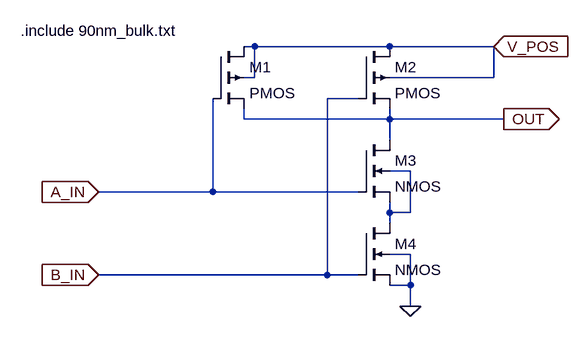
[diagram p0: schematic nand.asc]
nand.asc, the LTspice schematic file:
Version 4
SHEET 1 880 680
WIRE 96 48 80 48
WIRE 304 48 96 48
WIRE 464 48 304 48
WIRE 96 96 96 48
WIRE 96 96 80 96
WIRE 464 96 464 48
WIRE 464 96 304 96
WIRE 256 128 208 128
WIRE 80 160 80 144
WIRE 304 160 304 144
WIRE 304 160 80 160
WIRE 480 160 304 160
WIRE 304 192 304 160
WIRE 336 240 304 240
WIRE 32 272 32 128
WIRE 32 272 -144 272
WIRE 256 272 32 272
WIRE 304 304 304 288
WIRE 336 304 336 240
WIRE 336 304 304 304
WIRE 304 320 304 304
WIRE 336 368 304 368
WIRE 208 400 208 128
WIRE 208 400 -144 400
WIRE 256 400 208 400
WIRE 336 416 336 368
WIRE 336 416 304 416
WIRE 336 448 336 416
FLAG 464 48 V_POS
IOPIN 464 48 In
FLAG 480 160 OUT
IOPIN 480 160 Out
FLAG -144 272 A_IN
IOPIN -144 272 In
FLAG -144 400 B_IN
IOPIN -144 400 In
FLAG 336 448 0
SYMBOL pmos4 32 48 R0
SYMATTR InstName M1
SYMATTR Value2 l=90n w=400n
SYMBOL pmos4 256 48 R0
SYMATTR InstName M2
SYMATTR Value2 l=90n w=400n
SYMBOL nmos4 256 192 R0
SYMATTR InstName M3
SYMATTR Value2 l=90n w=200n
SYMBOL nmos4 256 320 R0
SYMATTR InstName M4
SYMATTR Value2 l=90n w=200n
TEXT -264 24 Left 2 !.include 90nm_bulk.txt

The netlist it stands for:
* nand.asc
M1 V_POS A_IN OUT V_POS PMOS l=90n w=400n
M2 V_POS B_IN OUT V_POS PMOS l=90n w=400n
M3 OUT A_IN N001 N001 NMOS l=90n w=200n
M4 N001 B_IN 0 0 NMOS l=90n w=200n
.model NMOS NMOS
.model PMOS PMOS
.lib standard.mos
.include 90nm_bulk.txt
.backanno
.end